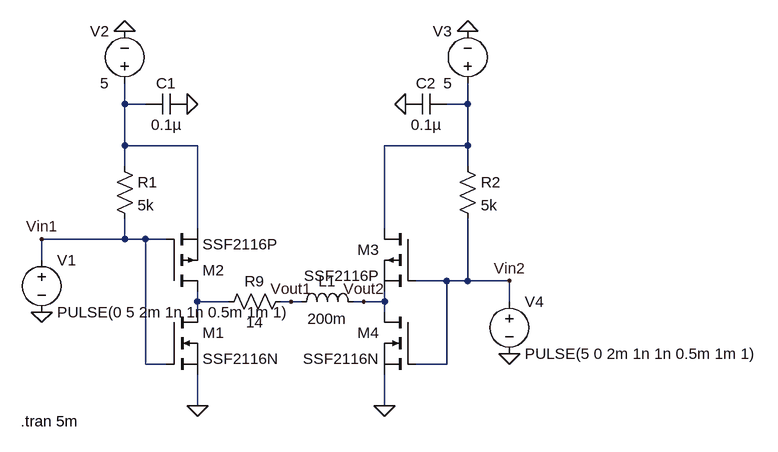
[diagram p0: schematic H-bridge 1.asc]
H-bridge 1.asc, the LTspice schematic file:
Version 4.1
SHEET 1 1184 680
WIRE 128 -96 128 -128
WIRE 160 -96 128 -96
WIRE 656 -96 656 -128
WIRE 656 -96 624 -96
WIRE 128 -32 128 -96
WIRE 240 -32 128 -32
WIRE 656 -32 656 -96
WIRE 656 -32 528 -32
WIRE 128 0 128 -32
WIRE 656 0 656 -32
WIRE 240 96 240 -32
WIRE 528 96 528 -32
WIRE 128 112 128 80
WIRE 128 112 0 112
WIRE 160 112 128 112
WIRE 192 112 160 112
WIRE 0 144 0 112
WIRE 624 176 576 176
WIRE 656 176 656 80
WIRE 656 176 624 176
WIRE 720 176 656 176
WIRE 240 208 240 192
WIRE 288 208 240 208
WIRE 384 208 368 208
WIRE 400 208 384 208
WIRE 496 208 480 208
WIRE 528 208 528 192
WIRE 528 208 496 208
WIRE 720 208 720 176
WIRE 240 224 240 208
WIRE 528 224 528 208
WIRE 160 304 160 112
WIRE 192 304 160 304
WIRE 624 304 624 176
WIRE 624 304 576 304
WIRE 240 368 240 320
WIRE 528 368 528 320
FLAG 240 368 0
FLAG 0 224 0
FLAG 224 -96 0
FLAG 128 -208 0
FLAG 0 112 Vin1
FLAG 528 368 0
FLAG 656 -208 0
FLAG 560 -96 0
FLAG 720 288 0
FLAG 384 208 Vout1
FLAG 496 208 Vout2
FLAG 720 176 Vin2
SYMBOL nmos 192 224 R0
SYMATTR InstName M1
SYMATTR Value SSF2116N
SYMBOL pmos 192 192 M180
SYMATTR InstName M2
SYMATTR Value SSF2116P
SYMBOL res 384 192 R90
WINDOW 0 0 56 VBottom 2
WINDOW 3 32 56 VTop 2
SYMATTR InstName R9
SYMATTR Value 14
SYMBOL voltage 0 128 R0
WINDOW 123 0 0 Left 0
WINDOW 39 0 0 Left 0
SYMATTR InstName V1
SYMATTR Value PULSE(0 5 2m 1n 1n 0.5m 1m 1)
SYMBOL res 112 -16 R0
SYMATTR InstName R1
SYMATTR Value 5k
SYMBOL cap 224 -112 R90
WINDOW 0 0 32 VBottom 2
WINDOW 3 32 32 VTop 2
SYMATTR InstName C1
SYMATTR Value 0.1µ
SYMBOL voltage 128 -112 R180
WINDOW 0 24 96 Left 2
WINDOW 3 24 16 Left 2
WINDOW 123 0 0 Left 0
WINDOW 39 0 0 Left 0
SYMATTR InstName V2
SYMATTR Value 5
SYMBOL ind 384 224 R270
WINDOW 0 32 56 VTop 2
WINDOW 3 5 56 VBottom 2
SYMATTR InstName L1
SYMATTR Value 200m
SYMBOL pmos 576 96 M0
SYMATTR InstName M3
SYMATTR Value SSF2116P
SYMBOL nmos 576 224 M0
SYMATTR InstName M4
SYMATTR Value SSF2116N
SYMBOL res 640 -16 R0
SYMATTR InstName R2
SYMATTR Value 5k
SYMBOL voltage 656 -112 R180
WINDOW 0 24 96 Left 2
WINDOW 3 24 16 Left 2
WINDOW 123 0 0 Left 0
WINDOW 39 0 0 Left 0
SYMATTR InstName V3
SYMATTR Value 5
SYMBOL cap 624 -112 R90
WINDOW 0 0 32 VBottom 2
WINDOW 3 32 32 VTop 2
SYMATTR InstName C2
SYMATTR Value 0.1µ
SYMBOL voltage 720 192 R0
WINDOW 123 0 0 Left 0
WINDOW 39 0 0 Left 0
SYMATTR InstName V4
SYMATTR Value PULSE(5 0 2m 1n 1n 0.5m 1m 1)
TEXT -32 392 Left 2 !.tran 5m

The netlist it stands for:
* H-bridge 1.asc
M1 N003 Vin1 0 0 SSF2116N
M2 N003 Vin1 N001 N001 SSF2116P
R9 Vout1 N003 14
V1 Vin1 0 PULSE(0 5 2m 1n 1n 0.5m 1m 1)
R1 N001 Vin1 5k
C1 0 N001 0.1µ
V2 N001 0 5
L1 Vout1 Vout2 200m
M3 N002 Vin2 Vout2 Vout2 SSF2116P
M4 Vout2 Vin2 0 0 SSF2116N
R2 N002 Vin2 5k
V3 N002 0 5
C2 N002 0 0.1µ
V4 Vin2 0 PULSE(5 0 2m 1n 1n 0.5m 1m 1)
.model NMOS NMOS
.model PMOS PMOS
.lib standard.mos
.tran 5m
.backanno
.end